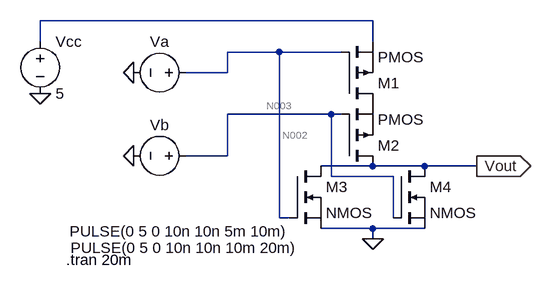
[diagram p0: schematic cmos_nor.asc]
cmos_nor.asc, the LTspice schematic file:
Version 4.1
SHEET 1 880 680
WIRE 272 0 -240 0
WIRE -240 32 -240 0
WIRE 272 32 272 0
WIRE 128 48 48 48
WIRE 224 48 128 48
WIRE 48 80 48 48
WIRE 48 80 -16 80
WIRE 208 144 48 144
WIRE 224 144 208 144
WIRE 48 208 48 144
WIRE 48 208 -16 208
WIRE 272 224 192 224
WIRE 352 224 272 224
WIRE 432 224 352 224
WIRE 208 240 208 144
WIRE 304 240 208 240
WIRE 128 304 128 48
WIRE 144 304 128 304
WIRE 304 304 304 240
WIRE 272 320 192 320
WIRE 352 320 272 320
WIRE 272 336 272 320
FLAG -240 112 0
FLAG -96 80 0
FLAG -96 208 0
FLAG 272 336 0
FLAG 432 224 Vout
IOPIN 432 224 Out
SYMBOL voltage -240 16 R0
SYMATTR InstName Vcc
SYMATTR Value 5
SYMBOL voltage 0 80 R90
WINDOW 0 -32 56 VBottom 2
WINDOW 3 229 26 VTop 2
WINDOW 123 0 0 Left 0
WINDOW 39 0 0 Left 0
SYMATTR InstName Va
SYMATTR Value PULSE(0 5 0 10n 10n 5m 10m)
SYMBOL voltage 0 208 R90
WINDOW 0 -32 56 VBottom 2
WINDOW 3 126 18 VTop 2
WINDOW 123 0 0 Left 0
WINDOW 39 0 0 Left 0
SYMATTR InstName Vb
SYMATTR Value PULSE(0 5 0 10n 10n 10m 20m)
SYMBOL pmos 224 128 M180
SYMATTR InstName M1
SYMBOL pmos 224 224 M180
SYMATTR InstName M2
SYMBOL nmos 144 224 R0
SYMATTR InstName M3
SYMBOL nmos 304 224 R0
SYMATTR InstName M4
TEXT -200 368 Left 2 !.tran 20m

The netlist it stands for:
* cmos_nor.asc
Vcc N001 0 5
Va N002 0 PULSE(0 5 0 10n 10n 5m 10m)
Vb N003 0 PULSE(0 5 0 10n 10n 10m 20m)
M1 P001 N002 N001 N001 PMOS
M2 Vout N003 P001 P001 PMOS
M3 Vout N002 0 0 NMOS
M4 Vout N003 0 0 NMOS
.model NMOS NMOS
.model PMOS PMOS
.lib standard.mos
.tran 20m
.backanno
.end

* Results of the author's LTspice run, read from the files saved beside the schematic
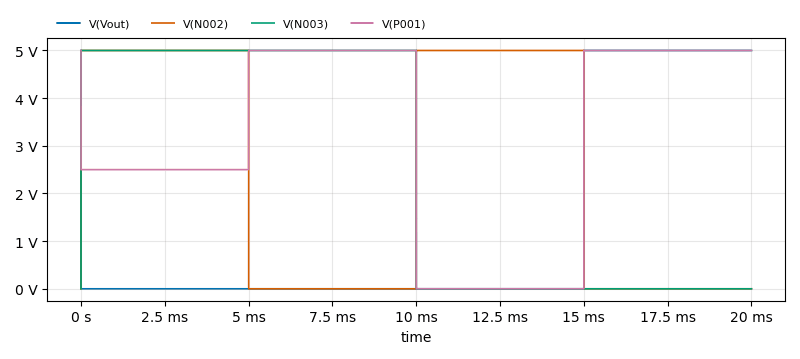
[diagram p1: Transient Analysis of cmos_nor.asc, plotted from the saved traces]
* Transient Analysis, 1 run:
*   V(Vout): min 0 V, max 5.003 V, average 1.25 V, rms 2.5 V, last 5 V
*   V(N002): min 0 V, max 5 V, average 2.5 V, rms 3.536 V, last 0 V
*   V(N003): min 0 V, max 5 V, average 2.5 V, rms 3.536 V, last 0 V
*   V(P001): min 1 mV, max 5.002 V, average 3.125 V, rms 3.75 V, last 5 V